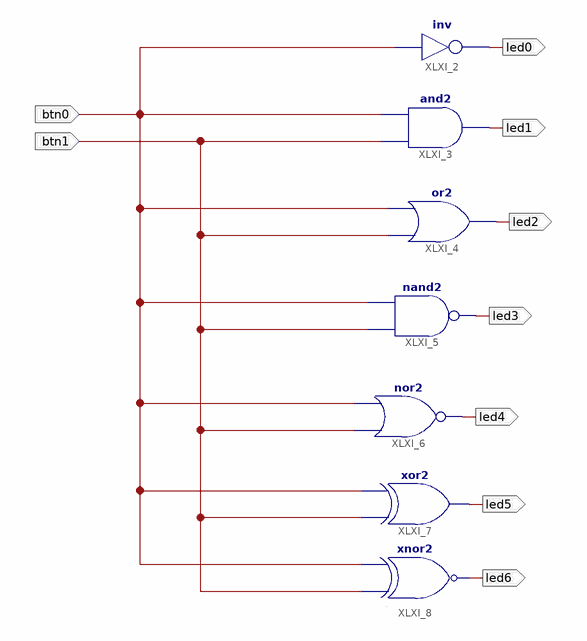
[diagram p0: schematic sheet 1]
// Xilinx ISE schematic porti_logice_maslinca.sch (spartan3e) as structural Verilog: 7 symbols, 9 ports
module porti_logice_maslinca (
  input  btn0,
  input  btn1,
  output led0,
  output led1,
  output led2,
  output led3,
  output led4,
  output led5,
  output led6
);

  not XLXI_2 (led0, btn0);
  and XLXI_3 (led1, btn1, btn0);
  or XLXI_4 (led2, btn1, btn0);
  nand XLXI_5 (led3, btn1, btn0);
  nor XLXI_6 (led4, btn1, btn0);
  xor XLXI_7 (led5, btn1, btn0);
  xnor XLXI_8 (led6, btn1, btn0);
endmodule
